# Altium project ra-chan.PrjPCB
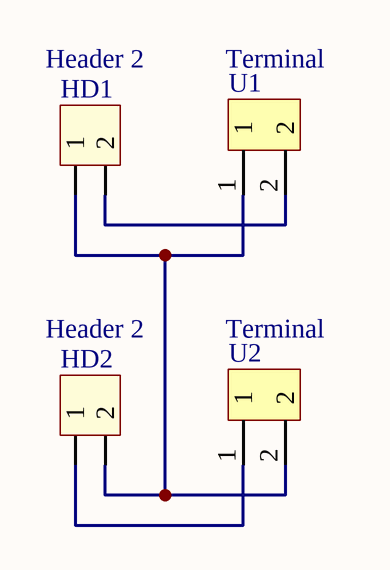
[diagram p0: ra-chan.SchDoc]
1 sheet, 4 parts. Net scope: global (net labels, ports and power ports of the same name join across sheets).
Board files: Ra-chan.PcbDoc, PCB1.PcbDoc

## Sheet ra-chan.SchDoc
size A3

### Parts
HD1  Header 2  [HED2]
HD2  Header 2  [HED2]
U1  Terminal  [Terminal 5.08]
U2  Terminal  [Terminal 5.08]

### Nets
NetHD1_1: HD1.1 HD2.2 U1.1 U2.2
NetHD1_2: HD1.2 U1.2
NetHD2_1: HD2.1 U2.1

### Library data of the parts
HD1 HD2 = Hed2: Header 2 (Green); Value: Header 2
U1 U2 = TERMINAL5.08